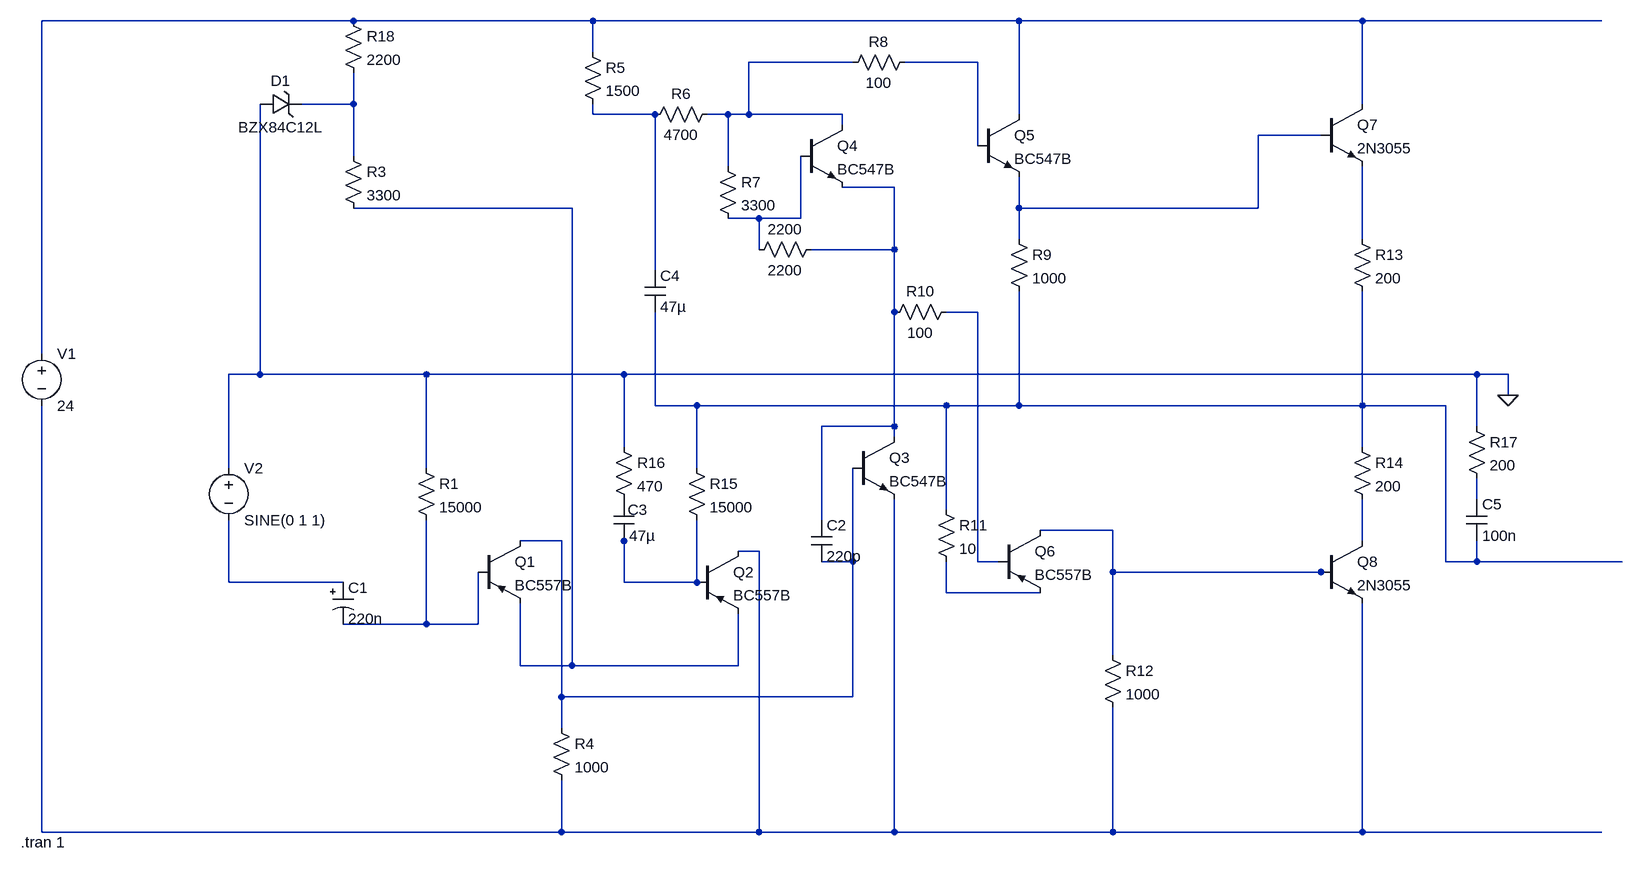
[diagram p0: schematic 3055.asc]
3055.asc, the LTspice schematic file:
Version 4
SHEET 1 2388 900
WIRE 432 -400 -48 -400
WIRE 800 -400 432 -400
WIRE 1456 -400 800 -400
WIRE 1984 -400 1456 -400
WIRE 2352 -400 1984 -400
WIRE 800 -352 800 -400
WIRE 1200 -336 1040 -336
WIRE 1392 -336 1280 -336
WIRE 432 -272 432 -320
WIRE 432 -272 352 -272
WIRE 1984 -272 1984 -400
WIRE 800 -256 800 -272
WIRE 896 -256 800 -256
WIRE 1008 -256 976 -256
WIRE 1040 -256 1040 -336
WIRE 1040 -256 1008 -256
WIRE 1184 -256 1040 -256
WIRE 1456 -256 1456 -400
WIRE 1184 -240 1184 -256
WIRE 1920 -224 1824 -224
WIRE 1392 -208 1392 -336
WIRE 432 -192 432 -272
WIRE 1008 -176 1008 -256
WIRE 1264 -144 1184 -144
WIRE 768 -112 432 -112
WIRE 1456 -112 1456 -160
WIRE 1824 -112 1824 -224
WIRE 1824 -112 1456 -112
WIRE 1056 -96 1008 -96
WIRE 1120 -96 1120 -192
WIRE 1120 -96 1056 -96
WIRE 1456 -64 1456 -112
WIRE 1984 -64 1984 -176
WIRE 1056 -48 1056 -96
WIRE 1264 -48 1264 -144
WIRE 1264 -48 1136 -48
WIRE 896 -16 896 -256
WIRE 1264 48 1264 -48
WIRE 1392 48 1344 48
WIRE -48 112 -48 -400
WIRE 288 144 288 -272
WIRE 288 144 240 144
WIRE 544 144 288 144
WIRE 848 144 544 144
WIRE 2160 144 848 144
WIRE 2208 144 2160 144
WIRE 2208 176 2208 144
WIRE 896 192 896 48
WIRE 960 192 896 192
WIRE 1344 192 960 192
WIRE 1456 192 1456 16
WIRE 1456 192 1344 192
WIRE 1984 192 1984 16
WIRE 1984 192 1456 192
WIRE 2112 192 1984 192
WIRE 1264 224 1264 48
WIRE 1264 224 1152 224
WIRE 2160 224 2160 144
WIRE 1264 240 1264 224
WIRE 848 256 848 144
WIRE 1984 256 1984 192
WIRE 240 288 240 144
WIRE 544 288 544 144
WIRE 960 288 960 192
WIRE 2160 336 2160 304
WIRE 1344 352 1344 192
WIRE 1152 368 1152 224
WIRE 1600 384 1488 384
WIRE 752 400 688 400
WIRE 848 400 848 384
WIRE 1984 400 1984 336
WIRE 1056 416 1024 416
WIRE 1200 432 1200 288
WIRE 1200 432 1152 432
WIRE 1392 432 1392 48
WIRE 1424 432 1392 432
WIRE 2112 432 2112 192
WIRE 2160 432 2160 400
WIRE 2160 432 2112 432
WIRE 2384 432 2160 432
WIRE 1600 448 1600 384
WIRE 1920 448 1600 448
WIRE 1936 448 1920 448
WIRE 240 464 240 368
WIRE 416 464 240 464
WIRE 848 464 848 400
WIRE 960 464 960 368
WIRE 960 464 848 464
WIRE 1344 480 1344 432
WIRE 1488 480 1344 480
WIRE 544 528 544 368
WIRE 544 528 416 528
WIRE 624 528 624 448
WIRE 624 528 544 528
WIRE 1600 576 1600 448
WIRE 688 592 688 496
WIRE 768 592 768 -112
WIRE 768 592 688 592
WIRE 1024 592 1024 512
WIRE 1024 592 768 592
WIRE 752 640 752 400
WIRE 1200 640 1200 432
WIRE 1200 640 752 640
WIRE 752 688 752 640
WIRE -48 848 -48 192
WIRE 752 848 752 768
WIRE 752 848 -48 848
WIRE 1056 848 1056 416
WIRE 1056 848 752 848
WIRE 1264 848 1264 336
WIRE 1264 848 1056 848
WIRE 1600 848 1600 656
WIRE 1600 848 1264 848
WIRE 1984 848 1984 496
WIRE 1984 848 1600 848
WIRE 2352 848 1984 848
FLAG 2208 176 0
SYMBOL voltage -48 96 R0
WINDOW 123 0 0 Left 0
WINDOW 39 0 0 Left 0
SYMATTR InstName V1
SYMATTR Value 24
SYMBOL voltage 240 272 R0
WINDOW 123 0 0 Left 0
WINDOW 39 0 0 Left 0
SYMATTR InstName V2
SYMATTR Value SINE(0 1 1)
SYMBOL pnp 624 400 R0
SYMATTR InstName Q1
SYMATTR Value BC557B
SYMBOL polcap 400 464 R0
WINDOW 3 24 56 Left 2
SYMATTR Value 220n
SYMATTR InstName C1
SYMATTR Description Capacitor
SYMATTR Type cap
SYMATTR SpiceLine V=16 Irms=0 Rser=11 Lser=0
SYMBOL res 528 272 R0
SYMATTR InstName R1
SYMATTR Value 15000
SYMBOL pnp 960 416 R0
SYMATTR InstName Q2
SYMATTR Value BC557B
SYMBOL zener 288 -256 R270
WINDOW 0 36 32 VTop 2
WINDOW 3 -4 32 VBottom 2
SYMATTR InstName D1
SYMATTR Value BZX84C12L
SYMBOL res 416 -208 R0
SYMATTR InstName R3
SYMATTR Value 3300
SYMBOL res 736 672 R0
SYMATTR InstName R4
SYMATTR Value 1000
SYMBOL npn 1200 240 R0
SYMATTR InstName Q3
SYMATTR Value BC547B
SYMBOL npn 1120 -240 R0
SYMATTR InstName Q4
SYMATTR Value BC547B
SYMBOL cap 1136 368 R0
SYMATTR InstName C2
SYMATTR Value 220p
SYMBOL res 784 -368 R0
SYMATTR InstName R5
SYMATTR Value 1500
SYMBOL res 992 -272 R90
WINDOW 0 0 56 VBottom 2
WINDOW 3 32 56 VTop 2
SYMATTR InstName R6
SYMATTR Value 4700
SYMBOL res 992 -192 R0
SYMATTR InstName R7
SYMATTR Value 3300
SYMBOL res 1152 -64 R90
WINDOW 0 0 56 VBottom 2
WINDOW 3 32 56 VTop 2
SYMATTR InstName 2200
SYMATTR Value 2200
SYMBOL res 1296 -352 R90
WINDOW 0 0 56 VBottom 2
WINDOW 3 32 56 VTop 2
SYMATTR InstName R8
SYMATTR Value 100
SYMBOL npn 1392 -256 R0
SYMATTR InstName Q5
SYMATTR Value BC547B
SYMBOL res 1440 -80 R0
SYMATTR InstName R9
SYMATTR Value 1000
SYMBOL res 1360 32 R90
WINDOW 0 0 56 VBottom 2
WINDOW 3 32 56 VTop 2
SYMATTR InstName R10
SYMATTR Value 100
SYMBOL pnp 1424 384 R0
SYMATTR InstName Q6
SYMATTR Value BC557B
SYMBOL res 1328 336 R0
SYMATTR InstName R11
SYMATTR Value 10
SYMATTR SpiceLine pwr=0.5
SYMBOL res 1584 560 R0
SYMATTR InstName R12
SYMATTR Value 1000
SYMBOL npn 1920 -272 R0
SYMATTR InstName Q7
SYMATTR Value 2N3055
SYMBOL npn 1920 400 R0
SYMATTR InstName Q8
SYMATTR Value 2N3055
SYMBOL res 1968 -80 R0
SYMATTR InstName R13
SYMATTR Value 200
SYMATTR SpiceLine pwr=5
SYMBOL res 1968 240 R0
SYMATTR InstName R14
SYMATTR Value 200
SYMATTR SpiceLine pwr=5
SYMBOL res 944 272 R0
SYMATTR InstName R15
SYMATTR Value 15000
SYMBOL cap 832 336 R0
WINDOW 0 22 16 Left 2
SYMATTR InstName C3
SYMATTR Value 47µ
SYMBOL res 832 240 R0
SYMATTR InstName R16
SYMATTR Value 470
SYMBOL cap 880 -16 R0
SYMATTR InstName C4
SYMATTR Value 47µ
SYMBOL res 2144 208 R0
SYMATTR InstName R17
SYMATTR Value 200
SYMATTR SpiceLine pwr=0.5
SYMBOL cap 2144 336 R0
SYMATTR InstName C5
SYMATTR Value 100n
SYMBOL res 416 -416 R0
SYMATTR InstName R18
SYMATTR Value 2200
TEXT -80 864 Left 2 !.tran 1

The netlist it stands for:
* 3055.asc
V1 N001 N018 24
V2 0 N019 SINE(0 1 1)
Q1 N015 N021 N008 0 BC557B
C1 N019 N021 220n V=16 Irms=0 Rser=11 Lser=0
R1 0 N021 15000
Q2 N018 N016 N008 0 BC557B
D1 0 N004 BZX84C12L
R3 N004 N008 3300
R4 N015 N018 1000
Q3 N007 N015 N018 0 BC547B
Q4 N002 N009 N007 0 BC547B
C2 N007 N015 220p
R5 N001 N005 1500
R6 N002 N005 4700
R7 N002 N009 3300
R§2200 N007 N009 2200
R8 N003 N002 100
Q5 N001 N003 N006 0 BC547B
R9 N006 N012 1000
R10 N011 N007 100
Q6 N014 N011 N020 0 BC557B
R11 N012 N020 10 pwr=0.5
R12 N014 N018 1000
Q7 N001 N006 N010 0 2N3055
Q8 N017 N014 N018 0 2N3055
R13 N010 N012 200 pwr=5
R14 N012 N017 200 pwr=5
R15 N012 N016 15000
C3 P001 N016 47µ
R16 0 P001 470
C4 N005 N012 47µ
R17 0 N013 200 pwr=0.5
C5 N013 N012 100n
R18 N001 N004 2200
.model D D
.lib standard.dio
.model NPN NPN
.model PNP PNP
.lib standard.bjt
.tran 1
.backanno
.end